# Altium schematic sheet OvenPi.SchDoc
size A
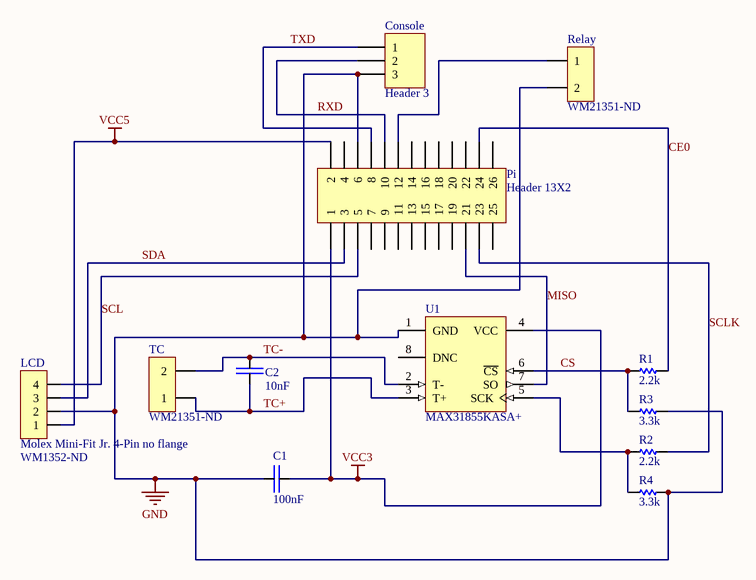
[diagram p0: OvenPi.SchDoc]

## Parts
C1  value 100nF  [0603_B]  (hidden comment: GRM188F51E105ZA12D)
C2  value 10nF  [0603_B]  (hidden comment: GRM188F51E105ZA12D)
Console  Header 3  [HDR1X3]
LCD  Molex Mini-Fit Jr. 4-Pin no flange  Supplier Part Number 1: WM1352-ND  [Molex Mini-Fit Jr. 4-Pin - no flange]
Pi  Header 13X2  [HDR2X13]
R1  value 2.2k  [0603_B]  (hidden comment: CRCW06032K40JNEA)
R2  value 2.2k  [0603_B]  (hidden comment: CRCW06032K40JNEA)
R3  value 3.3k  [0603_B]  (hidden comment: CRCW06032K40JNEA)
R4  value 3.3k  [0603_B]  (hidden comment: CRCW06032K40JNEA)
Relay  Supplier Part Number 1: WM21351-ND  [Mini-Fit Jr. 2]  (hidden comment: Mini-Fit Jr. 2-pin)
TC  Supplier Part Number 1: WM21351-ND  [Mini-Fit Jr. 2]  (hidden comment: Mini-Fit Jr. 2-pin)
U1  MAX31855KASA+  [MAXM-S8+4_N]

## Nets
GND: C1.1 Console.3 LCD.2 Pi.6 R3.2 R4.2 Relay.2 U1.1(GND)
VCC3: C1.2 Pi.1 U1.4(VCC)
VCC5: LCD.1 Pi.2
CE0: Pi.24 R1.2
CS: R1.1 R3.1 U1.6(~{CS})
MISO: Pi.21 U1.7(SO)
RXD: Console.2 Pi.10
SCL: LCD.4 Pi.5
SCLK: Pi.23 R2.2
SDA: LCD.3 Pi.3
TC+: C2.2 TC.1 U1.3(T+)
TC-: C2.1 TC.2 U1.2(T-)
TXD: Console.1 Pi.8
NetPi_12: Pi.12 Relay.1
NetR2_1: R2.1 R4.1 U1.5(SCK)

Not connected (* = marked no-connect by the designer): Pi 4 7 9 11 13 14 15 16 17 18 19 20 22 25 26; U1 8(DNC)

## Library data of the parts
C1 C2 = GRM188F51E105ZA12D: 1uF Ceramic SMT 0603; ComponentLink1Description: Datasheet; ComponentLink1URL: http://search.murata.co.jp/Ceramy/image/img/PDF/ENG/GRM188R71H103KA01.pdf; ComponentLink2Description: Supplier 1; ComponentLink2URL: http://search.digikey.com/scripts/DkSearch/dksus.dll?Detail&name=490-1512-1-ND
Console = Header 3: Header, 3-Pin; LatestRevisionDate: 17-Jul-2002; LatestRevisionNote: Re-released for DXP Platform.; Publisher: Altium Limited
LCD = Molex Mini-Fit Jr. 4-Pin: 4-Pin Molex Mini-Fit Jr. Header; Manufacturer Part Number: 0039301040; Connector Type: Header, Shrouded; Number of Positions: 4; Number of Positions Loaded: All; Pitch: 0.165" (4.20mm); Drawn By: Aaron Mills; Drawing Date: Jan. 2, 2011; Manufacturer: Molex; ComponentLink1URL: http://www.molex.com/pdm_docs/sd/039295043_sd.pdf; ComponentLink1Description: Datasheet; Supplier1: http://search.digikey.com/us/en/products/39-30-1040/WM1352-ND/561079; Supplier 1: Digi-Key; RoHS: RoHS Compliant; Category: Connectors, Interconnects; Stock 1: 4191; Pricing 1: 1=0.77, 10=0.674, 25=0.6344, 50=0.6078, 100=0.5815, 250=0.5286, 500=0.47574, 1000=0.42288, 2500=0.38324 (USD); Contact Type: Male Pin; Number of Rows: 2; Row Spacing: 0.165" (4.20mm); Contact Mating Length: -; Mounting Type: Through Hole, Right Angle; Termination: Solder; Fastening Type: Locking Ramp; Features: Board Lock; Contact Finish: Tin; Contact Finish Thickness: 100µin (2.54µm); Color: Natural; Packaging: Tray; ComponentLink2URL: http://www.molex.com/pdm_docs/sd/039301040_sd.pdf; ComponentLink2Description: http://www.molex.com/pdm_docs/sd/039301040_sd.pdf
Pi = Header 13X2: Header, 13-Pin, Dual row; LatestRevisionDate: 17-Jul-2002; LatestRevisionNote: Re-released for DXP Platform.; Publisher: Altium Limited
R1-R4 = CRCW06032K40JNEA: 0603 2.4kOhm resistor; ComponentLink1Description: Datasheet; ComponentLink1URL: http://www.bourns.com/data/global/pdfs/CHPREZTR.pdf
Relay TC = Mini-Fit Jr. 2-pin: Mini-Fit Jr. 2-pin Right Angle; Manufacturer: Molex Inc; Manufacturer Part Number: 0039300020; Connector Type: Header, Shrouded; Number of Positions: 2; Number of Positions Loaded: All; Row Spacing: 0.165" (4.20mm); Ordering: http://search.digikey.com/scripts/DkSearch/dksus.dll?Detail&name=WM1351-ND; Datasheet: http://www.molex.com/pdm_docs/sd/039301020_sd.pdf; Supplier 1: Digi-Key; RoHS: RoHS Compliant; Category: Connectors, Interconnects; Stock 1: 371; Pricing 1: 1=0.77, 10=0.674, 50=0.6078, 100=0.5815, 250=0.5286, 500=0.47574, 1000=0.42288, 2500=0.38324, 5000=0.37002 (USD); Contact Type: Male Pin; Pitch: -; Number of Rows: 2; Contact Mating Length: -; Mounting Type: Through Hole, Right Angle; Termination: Solder; Fastening Type: Locking Ramp; Features: Board Lock; Contact Finish: Tin; Contact Finish Thickness: 200µin (5.08µm); Color: Natural; Packaging: Tray; ComponentLink1URL: http://www.molex.com/pdm_docs/sd/039300020_sd.pdf; ComponentLink1Description: http://www.molex.com/pdm_docs/sd/039300020_sd.pdf
U1 = MAX31855KASA+: Cold Junction Compensated Thermocouple to Digital Converter, 14 Bits Temperature Resolution, -40 to 125 degC, 8-Pin SOIC (S8+4), Pb-Free; Functions: Thermocouple-to-Digital Converter; Interface: SPI; Parasite Pwr.: No; DatasheetVersion: Rev. 2; PackageVersion: Rev. D, 10/2012; PackageReference: S8+4; PackageDescription: 8-Pin Small-Outline IC, Narrow, Body 3.9 x 4.9 mm, Pitch 1.27 mm; Supplier 1: Digi-Key; Supplier Part Number 1: MAX31855KASA+-ND; Supplier 2: Mouser; Supplier Part Number 2: 700-MAX31855KASA+; Generic Part Number: MAX31855; Mounting Technology: Surface Mount; Code_JEDEC: MS-012; PartNumber: MAX31855KASA+; ComponentLink1Description: Manufacturer URL; ComponentLink1URL: http://www.maximintegrated.com/; ComponentLink2Description: Datasheet; ComponentLink2URL: http://datasheets.maximintegrated.com/en/ds/MAX31855.pdf; ComponentLink3Description: Package Specification; ComponentLink3URL: http://pdfserv.maximintegrated.com/package_dwgs/21-0041.PDF